# Altium schematic sheet thesis.SchDoc: Bachelor Thesis ESC (part 1 of 3)
size 635 x 381 mm; Date: 21.04.2022; DrawnBy: Victor Moland; Revision: 2; SheetNumber: 1; SheetTotal: 2
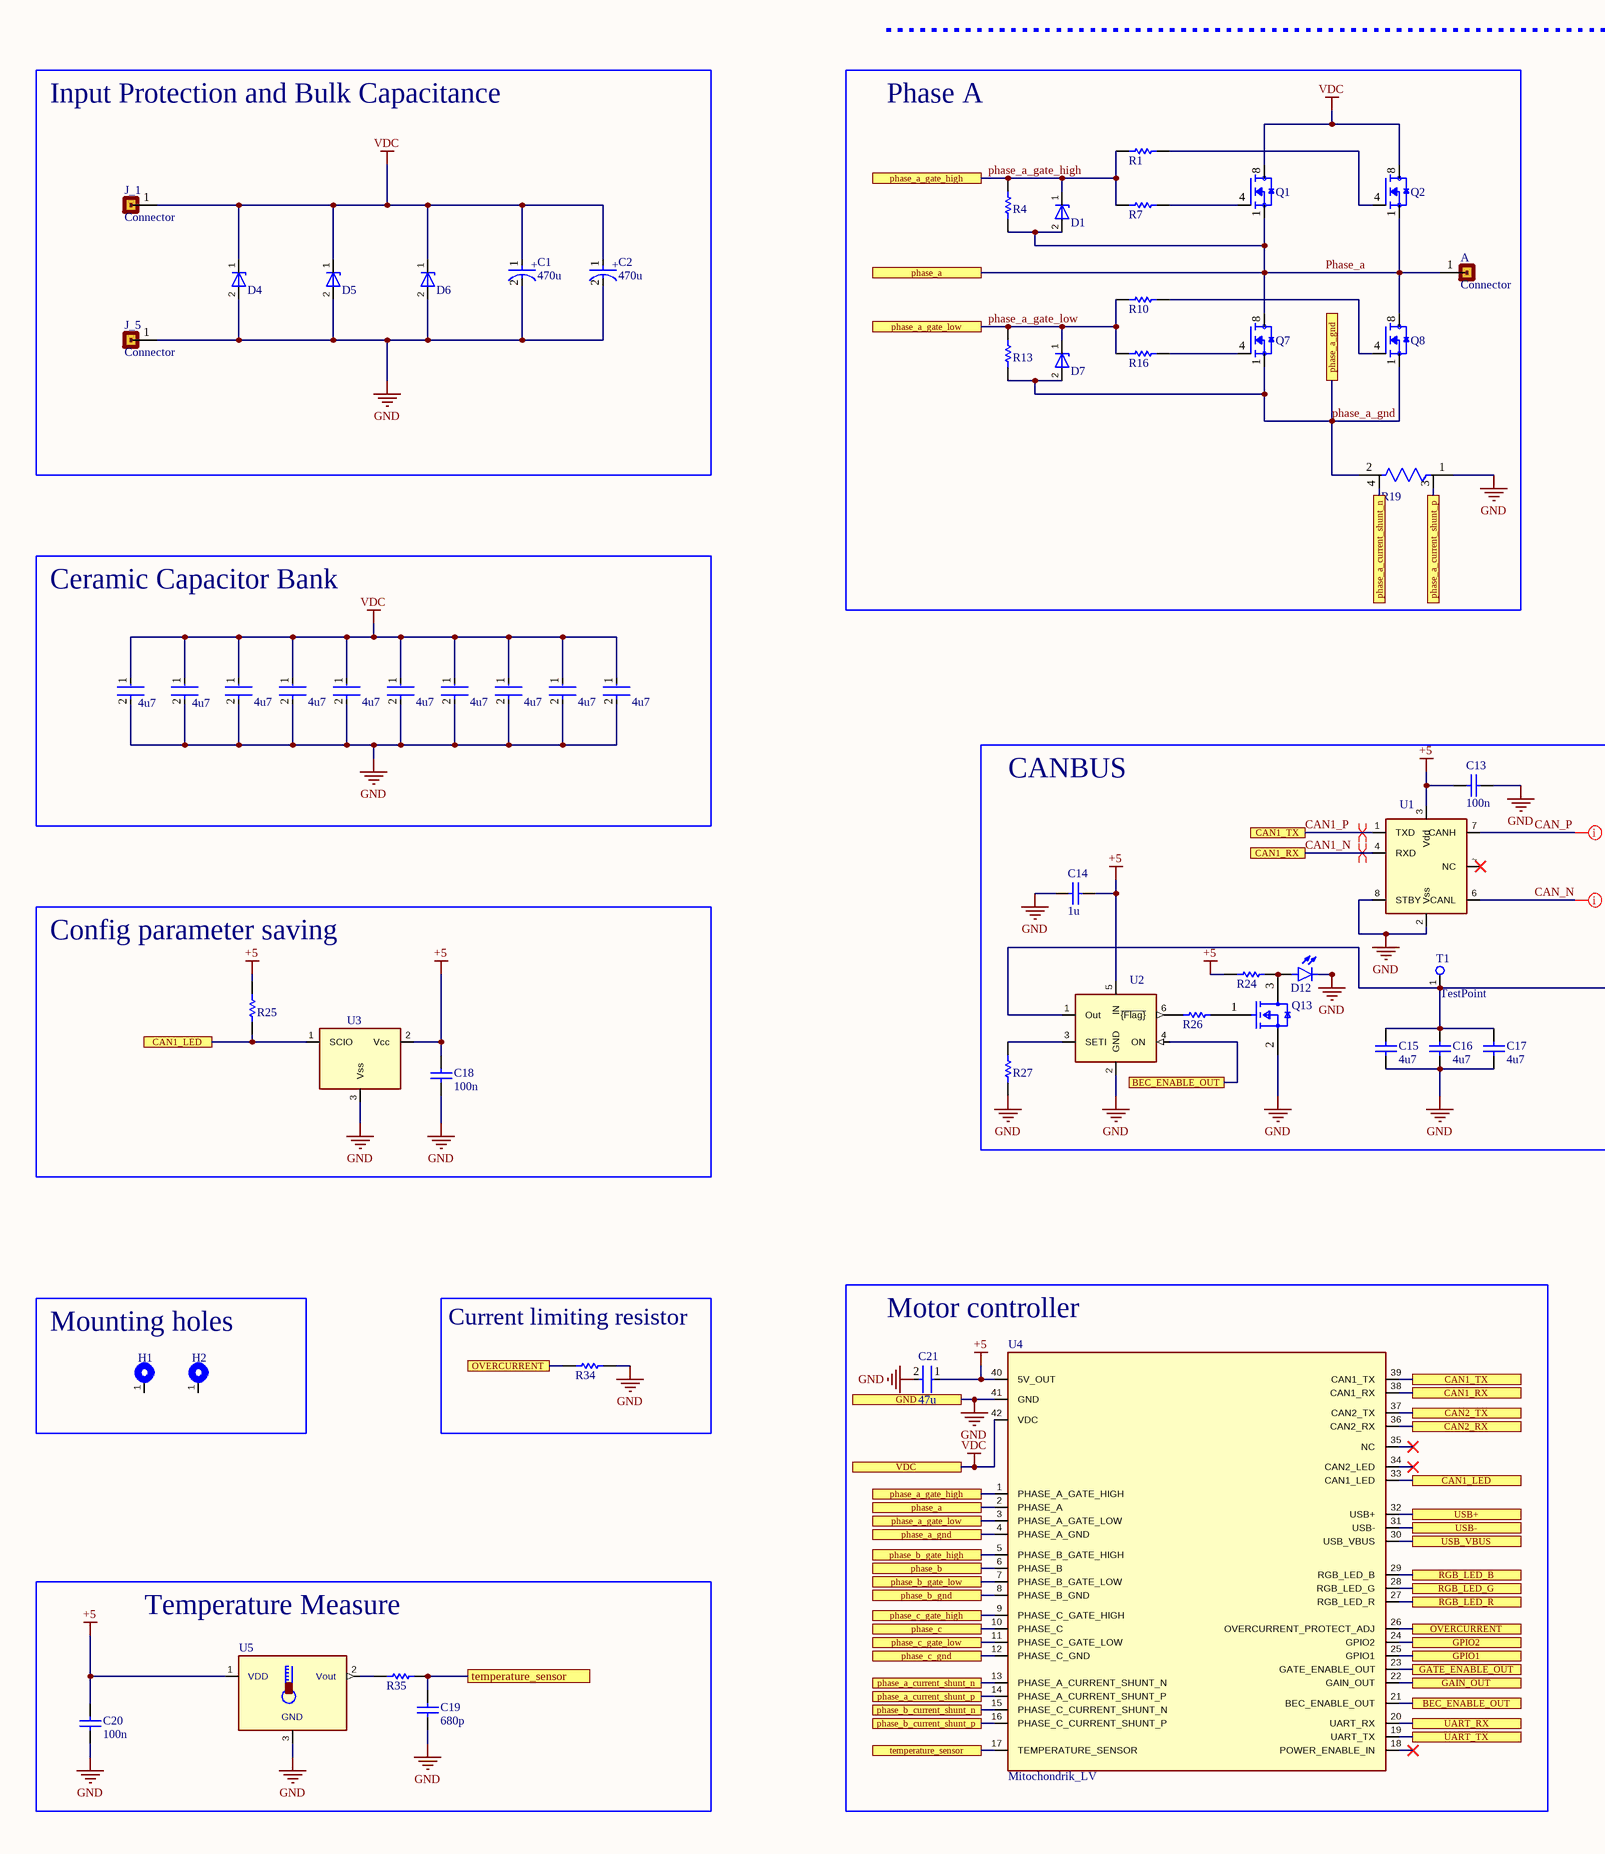
[diagram p0: thesis.SchDoc, left]
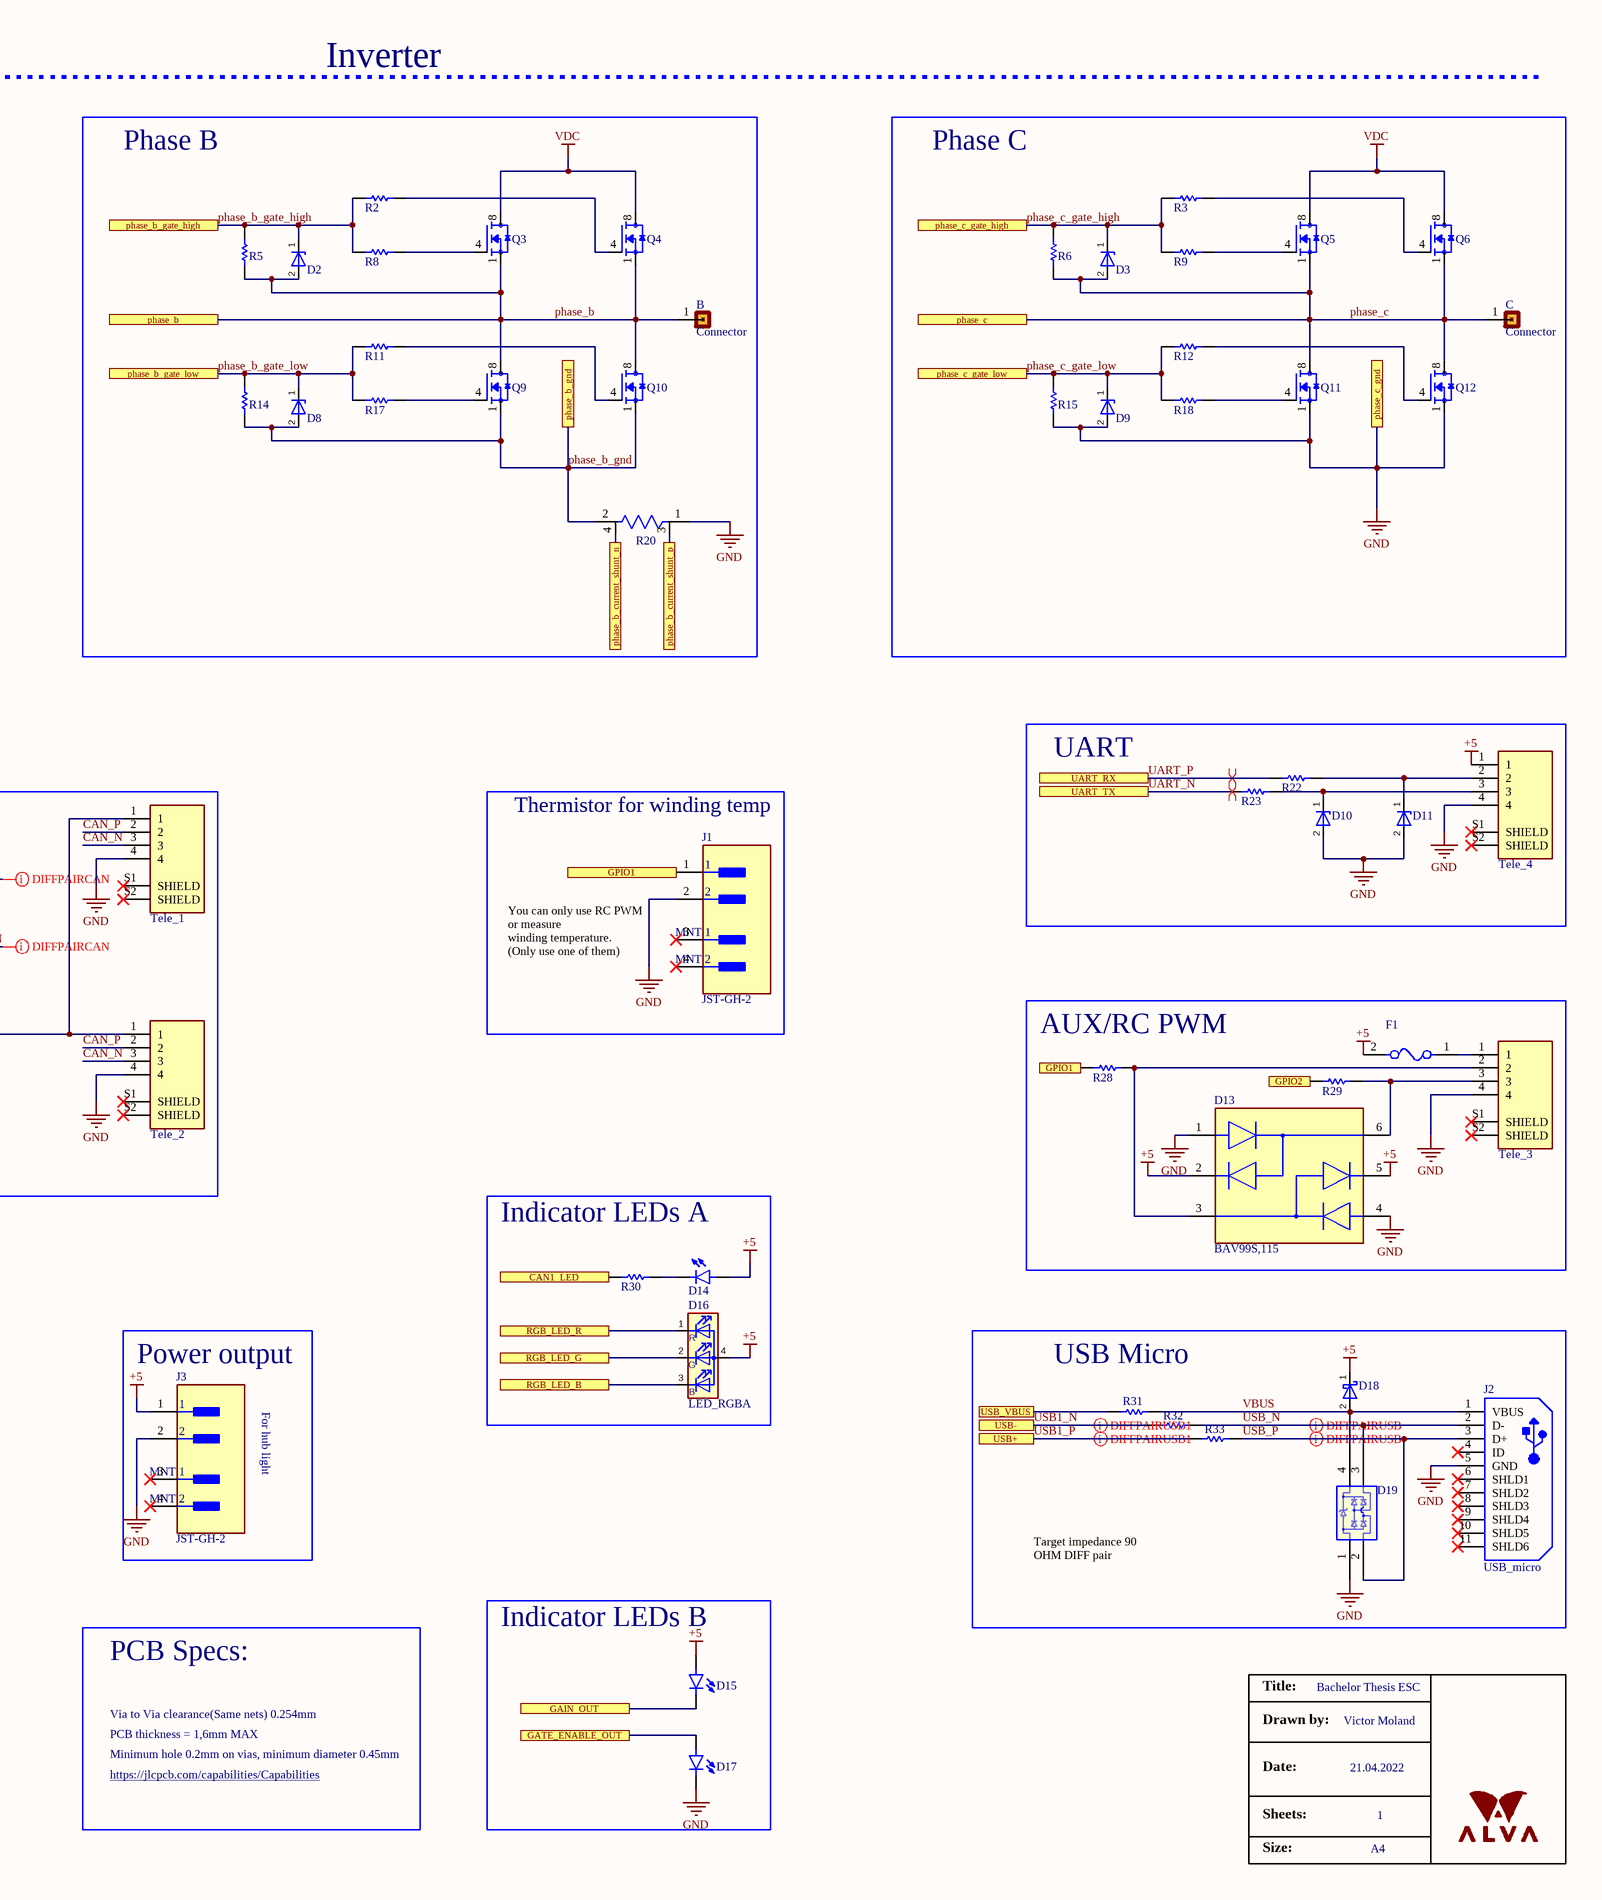
[diagram p1: thesis.SchDoc, right]

## Parts
*  LOGO  (value not drawn)
A  Connector  [Conn_01x01]
B  Connector  [Conn_01x01]
C  Connector  [Conn_01x01]
C1  470u  [Cap_radial]
C2  470u  [Cap_radial]
C3  4u7  [Cap_1210]
C4  4u7  [Cap_1210]
C5  4u7  [Cap_1210]
C6  4u7  [Cap_1210]
C7  4u7  [Cap_1210]
C8  4u7  [Cap_1210]
C9  4u7  [Cap_1210]
C10  4u7  [Cap_1210]
C11  4u7  [Cap_1210]
C12  4u7  [Cap_1210]
C13  100n  [CAP_0603]
C14  1u  [CAP_0603]
C15  4u7  [CAP_0603]
C16  4u7  [CAP_0603]
C17  4u7  [CAP_0603]
C18  100n  [CAP_0603]
C19  680p  [CAP_0603]
C20  100n  [CAP_0603]
C21  47u  [Cap_1210]
D1  BZD27C16PWHCT-ND  [Zener_16V]  (value not drawn)
D2  BZD27C16PWHCT-ND  [Zener_16V]  (value not drawn)
D3  BZD27C16PWHCT-ND  [Zener_16V]  (value not drawn)
D4  SMC5K51A-M3/IGICT-ND  [Zener_51V]  (value not drawn)
D5  SMC5K51A-M3/IGICT-ND  [Zener_51V]  (value not drawn)
D6  SMC5K51A-M3/IGICT-ND  [Zener_51V]  (value not drawn)
D7  BZD27C16PWHCT-ND  [Zener_16V]  (value not drawn)
D8  BZD27C16PWHCT-ND  [Zener_16V]  (value not drawn)
D9  BZD27C16PWHCT-ND  [Zener_16V]  (value not drawn)
D10  SMF5.0A-TPMSCT-ND  [Zener_5V]  (value not drawn)
D11  SMF5.0A-TPMSCT-ND  [Zener_5V]  (value not drawn)
D12  LED0603(LTW-C193TS5)  [LED0603]  (value not drawn)
D13  BAV99S,115  [BAV99S]
D14  LED0603(LTW-C193TS5)  [LED0603]  (value not drawn)
D15  LED0603(LTW-C193TS5)  [LED0603]  (value not drawn)
D16  LED_RGBA  [LED_0606]
D17  LED0603(LTW-C193TS5)  [LED0603]  (value not drawn)
D18  PMEG2010AEH  [PMEG2010AEH]  (value not drawn)
D19  DRTR5V0U2SR-7  [DRTR5V0OU2SR-7]  (value not drawn)
F1  Polyfuse  [Polyfuse]  (value not drawn)
H1  MountingHole_Pad  [Mounting_holes]  (value not drawn)
H2  MountingHole_Pad  [Mounting_holes]  (value not drawn)
J1  JST-GH-2  [JST-GH-2]
J2  USB_micro  [USB_micro]
J3  JST-GH-2  [JST-GH-2]
J_1  Connector  [Conn_01x01]
J_5  Connector  [Conn_01x01]
Q1  BSC021N08NS5ATMA1  [BSC021N08NS5ATMA1]  (value not drawn)
Q2  BSC021N08NS5ATMA1  [BSC021N08NS5ATMA1]  (value not drawn)
Q3  BSC021N08NS5ATMA1  [BSC021N08NS5ATMA1]  (value not drawn)
Q4  BSC021N08NS5ATMA1  [BSC021N08NS5ATMA1]  (value not drawn)
Q5  BSC021N08NS5ATMA1  [BSC021N08NS5ATMA1]  (value not drawn)
Q6  BSC021N08NS5ATMA1  [BSC021N08NS5ATMA1]  (value not drawn)
Q7  BSC021N08NS5ATMA1  [BSC021N08NS5ATMA1]  (value not drawn)
Q8  BSC021N08NS5ATMA1  [BSC021N08NS5ATMA1]  (value not drawn)
Q9  BSC021N08NS5ATMA1  [BSC021N08NS5ATMA1]  (value not drawn)
Q10  BSC021N08NS5ATMA1  [BSC021N08NS5ATMA1]  (value not drawn)
Q11  BSC021N08NS5ATMA1  [BSC021N08NS5ATMA1]  (value not drawn)
Q12  BSC021N08NS5ATMA1  [BSC021N08NS5ATMA1]  (value not drawn)
Q13  BSS138  [BSS138]  (value not drawn)
R1  4R3  [Res_0603]  (value not drawn)
R2  4R3  [Res_0603]  (value not drawn)
R3  4R3  [Res_0603]  (value not drawn)
R4  100k  [Res_0603]  (value not drawn)
R5  100k  [Res_0603]  (value not drawn)
R6  100k  [Res_0603]  (value not drawn)
R7  4R3  [Res_0603]  (value not drawn)
R8  4R3  [Res_0603]  (value not drawn)
R9  4R3  [Res_0603]  (value not drawn)
R10  4R3  [Res_0603]  (value not drawn)
R11  4R3  [Res_0603]  (value not drawn)
R12  4R3  [Res_0603]  (value not drawn)
R13  100k  [Res_0603]  (value not drawn)
R14  100k  [Res_0603]  (value not drawn)
R15  100k  [Res_0603]  (value not drawn)
R16  4R3  [Res_0603]  (value not drawn)
R17  4R3  [Res_0603]  (value not drawn)
R18  4R3  [Res_0603]  (value not drawn)
R19  2mOhm  [Shunt_res]  (value not drawn)
R20  2mOhm  [Shunt_res]  (value not drawn)
R22  4R3  [Res_0603]  (value not drawn)
R23  4R3  [Res_0603]  (value not drawn)
R24  1k  [Res_0603]  (value not drawn)
R25  1k  [Res_0603]  (value not drawn)
R26  200Ohm  [Res_0603]  (value not drawn)
R27  46k4  [Res_0603]  (value not drawn)
R28  100Ohm  [Res_0603]  (value not drawn)
R29  100Ohm  [Res_0603]  (value not drawn)
R30  1k  [Res_0603]  (value not drawn)
R31  1k  [Res_0603]  (value not drawn)
R32  4R3  [Res_0603]  (value not drawn)
R33  4R3  [Res_0603]  (value not drawn)
R34  R_curr  [Res_0603]  (value not drawn)
R35  R_filter  [Res_0603]  (value not drawn)
T1  TestPoint  [Testpoint]
Tele_1  JST-GH-4  [JST-GH-4]  (value not drawn)
Tele_2  JST-GH-4  [JST-GH-4]  (value not drawn)
Tele_3  JST-GH-4  [JST-GH-4]  (value not drawn)
Tele_4  JST-GH-4  [JST-GH-4]  (value not drawn)
U1  MCP2544FDT-E_MNY  [MCP2544FDT-E_MNY]  (value not drawn)
U2  MAX4995A  [MAX4995AAUT+T]  (value not drawn)
U3  11LC040T-E/TTTR-ND  [11LC040T-E/TTTR-ND]  (value not drawn)
U4  Mitochondrik_LV  [Mitochondrik_LV]
U5  TMP235AEDBZRQ1_1  [TMP235AEDBZRQ1]  (value not drawn)

## Blocks framed on the sheet
Input Protection and Bulk Capacitance: C1 C2 D4-D6 J_1 J_5
Phase A: A D1 D7 Q1 Q2 Q7 Q8 R1 R4 R7 R10 R13 R16 R19
Phase B: B D2 D8 Q3 Q4 Q9 Q10 R2 R5 R8 R11 R14 R17 R20
Phase C: C D3 D9 Q5 Q6 Q11 Q12 R3 R6 R9 R12 R15 R18
Ceramic Capacitor Bank: C3-C12
UART: D10 D11 R22 R23 Tele_4
CANBUS: C13-C17 D12 Q13 R24 R26 R27 T1 Tele_1 Tele_2 U1 U2
Thermistor for winding temp: J1
Config parameter saving: C18 R25 U3
AUX/RC PWM: D13 F1 R28 R29 Tele_3
Indicator LEDs A: D14 D16 R30
Mounting holes: H1 H2
Current limiting resistor: R34
Motor controller: C21 U4
Power output: J3
USB Micro: D18 D19 J2 R31-R33
Indicator LEDs B: D15 D17
Temperature Measure: C19 C20 R35 U5

## Ports
BEC_ENABLE_OUT, CAN1_LED, CAN1_RX, CAN1_TX, CAN2_RX, CAN2_TX, GAIN_OUT, GATE_ENABLE_OUT, GND, GPIO1, GPIO2, OVERCURRENT, phase_a, phase_a_current_shunt_n, phase_a_current_shunt_p, phase_a_gate_high, phase_a_gate_low, phase_a_gnd, phase_b, phase_b_current_shunt_n, phase_b_current_shunt_p, phase_b_gate_high, phase_b_gate_low, phase_b_gnd, phase_c, phase_c_gate_high, phase_c_gate_low, phase_c_gnd, RGB_LED_B, RGB_LED_G, RGB_LED_R, temperature_sensor, UART_RX, UART_TX, USB+, USB-, USB_VBUS, VDC

## Nets
+5: C13.1 C14.2 C18.2 C20.2 C21.1 D13.2(cathode(diode_2)) D13.5(cathode(diode_4)) D14.A D15.A D16.4(A) D18.1(K) F1.2 J3.1 R24.1 R25.2 Tele_4.1 U1.3(Vdd) U2.5(IN) U3.2(Vcc) U4.40(5V_OUT) U5.1
GND: C1.2 C2.2 C3.2 C4.2 C5.2 C6.2 C7.2 C8.2 C9.2 C10.2 C11.2 C12.2 C13.2 C14.1 C15.1 C16.1 C17.1 C18.1 C19.1 C20.1 C21.2 D4.2(A) D5.2(A) D6.2(A) D9.2(A) D10.2(A) D11.2(A) D12.C D13.1(anode(diode_1)) D13.4(anode(diode_3)) D17.C D19.1 J1.2 J2.5(GND) J3.2 J_5.1 Q11.1(S) Q12.1(S) Q13.2(S) R15.1 R19.1 R20.1 R27.1 R34.2 Tele_1.4 Tele_2.4 Tele_3.4 Tele_4.4 U1.2(Vss) U1.8(STBY) U2.2(GND) U3.3(Vss) U4.12(PHASE_C_GND) U4.41(GND) U5.3 ; port phase_c_gnd, port GND
VDC: C1.1 C2.1 C3.1 C4.1 C5.1 C6.1 C7.1 C8.1 C9.1 C10.1 C11.1 C12.1 D4.1(B) D5.1(B) D6.1(B) J_1.1 Q1.8(D) Q2.8(D) Q3.8(D) Q4.8(D) Q5.8(D) Q6.8(D) U4.42(VDC) ; port VDC
BEC_ENABLE_OUT: U2.4(ON) U4.21(BEC_ENABLE_OUT) ; port BEC_ENABLE_OUT
CAN1_LED: R25.1 R30.1 U3.1(SCIO) U4.33(CAN1_LED) ; port CAN1_LED
CAN1_N: U1.4(RXD) U4.38(CAN1_RX) ; port CAN1_RX
CAN1_P: U1.1(TXD) U4.39(CAN1_TX) ; port CAN1_TX
CAN2_RX: U4.36(CAN2_RX) ; port CAN2_RX
CAN2_TX: U4.37(CAN2_TX) ; port CAN2_TX
CAN_N: Tele_1.3 Tele_2.3 U1.6(CANL)
CAN_P: Tele_1.2 Tele_2.2 U1.7(CANH)
GAIN_OUT: D15.C U4.22(GAIN_OUT) ; port GAIN_OUT
GATE_ENABLE_OUT: D17.A U4.23(GATE_ENABLE_OUT) ; port GATE_ENABLE_OUT
GPIO1: J1.1 R28.1 U4.25(GPIO1) ; port GPIO1
GPIO2: R29.1 U4.24(GPIO2) ; port GPIO2
OVERCURRENT: R34.1 U4.26(OVERCURRENT_PROTECT_ADJ) ; port OVERCURRENT
Phase_a: A.1 D1.2(A) Q1.1(S) Q2.1(S) Q7.8(D) Q8.8(D) R4.1 U4.2(PHASE_A) ; port phase_a
phase_a_current_shunt_n: R19.4 U4.13(PHASE_A_CURRENT_SHUNT_N) ; port phase_a_current_shunt_n
phase_a_current_shunt_p: R19.3 U4.14(PHASE_A_CURRENT_SHUNT_P) ; port phase_a_current_shunt_p
phase_a_gate_high: D1.1(B) R1.1 R4.2 R7.1 U4.1(PHASE_A_GATE_HIGH) ; port phase_a_gate_high
phase_a_gate_low: D7.1(B) R10.1 R13.2 R16.1 U4.3(PHASE_A_GATE_LOW) ; port phase_a_gate_low
phase_a_gnd: D7.2(A) Q7.1(S) Q8.1(S) R13.1 R19.2 U4.4(PHASE_A_GND) ; port phase_a_gnd
phase_b: B.1 D2.2(A) Q3.1(S) Q4.1(S) Q9.8(D) Q10.8(D) R5.1 U4.6(PHASE_B) ; port phase_b
phase_b_current_shunt_n: R20.4 U4.15(PHASE_C_CURRENT_SHUNT_N) ; port phase_b_current_shunt_n
phase_b_current_shunt_p: R20.3 U4.16(PHASE_C_CURRENT_SHUNT_P) ; port phase_b_current_shunt_p
phase_b_gate_high: D2.1(B) R2.1 R5.2 R8.1 U4.5(PHASE_B_GATE_HIGH) ; port phase_b_gate_high
phase_b_gate_low: D8.1(B) R11.1 R14.2 R17.1 U4.7(PHASE_B_GATE_LOW) ; port phase_b_gate_low
phase_b_gnd: D8.2(A) Q9.1(S) Q10.1(S) R14.1 R20.2 U4.8(PHASE_B_GND) ; port phase_b_gnd
phase_c: C.1 D3.2(A) Q5.1(S) Q6.1(S) Q11.8(D) Q12.8(D) R6.1 U4.10(PHASE_C) ; port phase_c
phase_c_gate_high: D3.1(B) R3.1 R6.2 R9.1 U4.9(PHASE_C_GATE_HIGH) ; port phase_c_gate_high
phase_c_gate_low: D9.1(B) R12.1 R15.2 R18.1 U4.11(PHASE_C_GATE_LOW) ; port phase_c_gate_low
RGB_LED_B: D16.3(BK) U4.29(RGB_LED_B) ; port RGB_LED_B
RGB_LED_G: D16.2(GK) U4.28(RGB_LED_G) ; port RGB_LED_G
RGB_LED_R: D16.1(RK) U4.27(RGB_LED_R) ; port RGB_LED_R
temperature_sensor: C19.2 R35.2 U4.17(TEMPERATURE_SENSOR) ; port temperature_sensor
UART_N: R23.1 U4.19(UART_TX) ; port UART_TX
UART_P: R22.1 U4.20(UART_RX) ; port UART_RX
USB1_N: R32.1 U4.31(USB-) ; port USB-
USB1_P: R33.1 U4.32(USB+) ; port USB+
USB_N: D19.3 J2.2(D-) R32.2
USB_P: D19.2 J2.3(D+) R33.2
USB_VBUS: R31.1 U4.30(USB_VBUS) ; port USB_VBUS
VBUS: D18.2(A) D19.4 J2.1(VBUS) R31.2
NetC15_2: C15.2 C16.2 C17.2 T1.1 Tele_1.1 Tele_2.1 U2.1(Out)
NetD10_1: D10.1(B) R23.2 Tele_4.3
NetD11_1: D11.1(B) R22.2 Tele_4.2
NetD12_A: D12.A Q13.3(D) R24.2
NetD13_3: D13.3(cathode(diode_3)/anode(diode_4)) R28.2 Tele_3.2
NetD13_6: D13.6(cathode(diode_1)/anode(diode_2)) R29.2 Tele_3.3
NetD14_C: D14.C R30.2
NetF1_1: F1.1 Tele_3.1
NetQ1_4: Q1.4(G) R7.2
NetQ2_4: Q2.4(G) R1.2
NetQ3_4: Q3.4(G) R8.2
NetQ4_4: Q4.4(G) R2.2
NetQ5_4: Q5.4(G) R9.2
NetQ6_4: Q6.4(G) R3.2
NetQ7_4: Q7.4(G) R16.2
NetQ8_4: Q8.4(G) R10.2
NetQ9_4: Q9.4(G) R17.2
NetQ10_4: Q10.4(G) R11.2
NetQ11_4: Q11.4(G) R18.2
NetQ12_4: Q12.4(G) R12.2
NetQ13_1: Q13.1(G) R26.2
NetR26_1: R26.1 U2.6(~{{Flag}})
NetR27_2: R27.2 U2.3(SETI)
NetR35_1: R35.1 U5.2

Not connected (* = marked no-connect by the designer): H1 1; H2 1; J1 3(MNT_1)* 4(MNT_2)*; J2 4(ID)* 6(SHLD1)* 7(SHLD2)* 8(SHLD3)* 9(SHLD4)* 10(SHLD5)* 11(SHLD6)*; J3 3(MNT_1)* 4(MNT_2)*; Tele_1 S1(SHIELD)* S2(SHIELD)*; Tele_2 S1(SHIELD)* S2(SHIELD)*; Tele_3 S1(SHIELD)* S2(SHIELD)*; Tele_4 S1(SHIELD)* S2(SHIELD)*; U1 ~(NC)*; U4 18(POWER_ENABLE_IN)* 34(CAN2_LED)* 35(NC)*

## Layout directives
differential pair: CAN1_N, CAN1_P, CAN_N, CAN_P, USB1_N, USB1_P, USB_N, USB_P
differential pair; differential pair class DIFFPAIRS: UART_N, UART_P

## Notes on the sheet
- Inverter
- (near J1) You can only use RC PWM
  or measure
  winding temperature.
  (Only use one of them)
- For hub light
- Target impedance 90 OHM DIFF pair
- PCB Specs:
- Title:
- Bachelor Thesis ESC
- PCB thickness = 1,6mm MAX
- Minimum hole 0.2mm on vias, minimum diameter 0.45mm
- Via to Via clearance(Same nets) 0.254mm
- Drawn by:
- Victor Moland
- https://jlcpcb.com/capabilities/Capabilities
- Date:
- Sheets:
- 21.04.2022
- 1
- Size:
- A4
- (in symbol CAP_Radial) +
- (in symbol LED_RGBA) R; G; B
- (in symbol TMP235AEDBZRQ1_1) VDD; Vout; GND